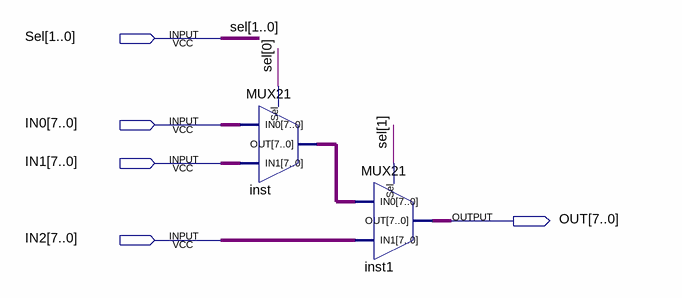
[diagram p0: schematic sheet]
// Quartus schematic MUX31.bdf as structural Verilog: 2 symbols, 5 pins
module MUX31 (
  input  [1:0] Sel,
  input  [7:0] IN0,
  input  [7:0] IN1,
  input  [7:0] IN2,
  output [7:0] OUT
);

  wire [7:0] inst_out;

  MUX21 inst (.Sel(Sel[0]), .IN0(IN0), .IN1(IN1), .OUT(inst_out));
  MUX21 inst1 (.Sel(Sel[1]), .IN0(inst_out), .IN1(IN2), .OUT(OUT));
endmodule
